# Altium schematic sheet [9]-RELAYS.SchDoc
size A4
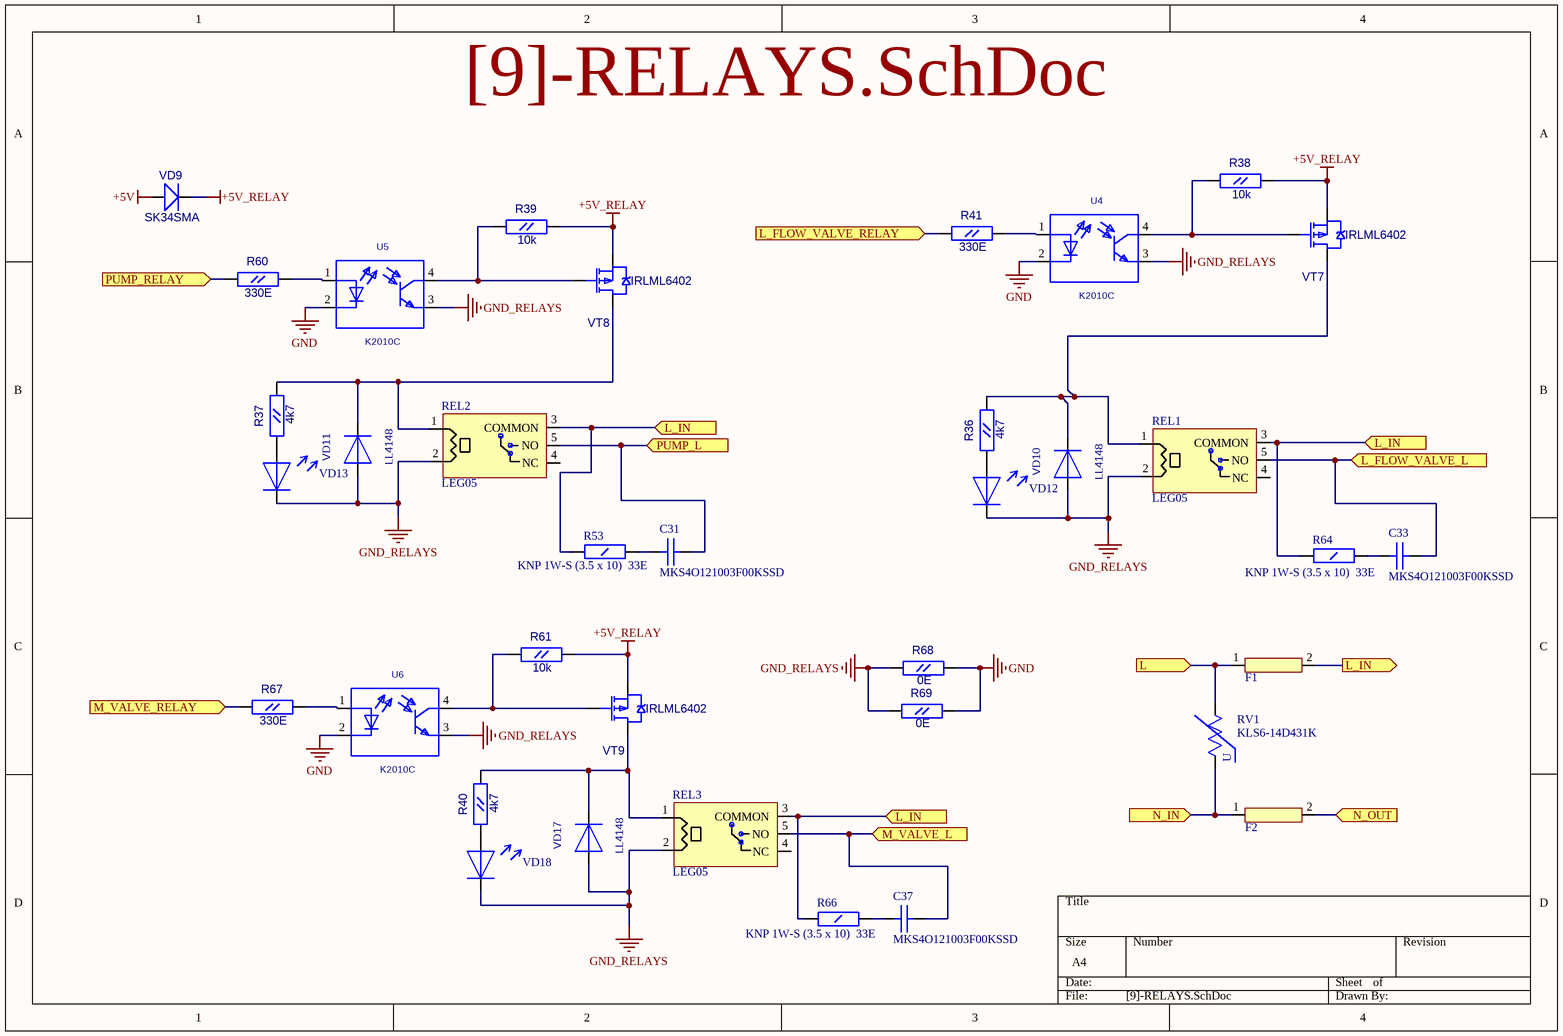
[diagram p0: [9]-RELAYS.SchDoc]

## Parts
C31  MKS4O121003F00KSSD  [CAP_HV_13x5]
C33  MKS4O121003F00KSSD  [CAP_HV_13x5]
C37  MKS4O121003F00KSSD  [CAP_HV_13x5]
F1  KLS5-266(5x20)  [Fuse_5x20]  (value not drawn)
F2  KLS5-266(5x20)  [Fuse_5x20]  (value not drawn)
R36  4k7  [RC0603]
R37  4k7  [RC0603]
R38  10k  [RC0603]
R39  10k  [RC0603]
R40  4k7  [RC0603]
R41  330E  [RC0603]
R53  KNP 1W-S (3.5 x 10)  33E  [RES_10x4_THD]
R60  330E  [RC0603]
R61  10k  [RC0603]
R64  KNP 1W-S (3.5 x 10)  33E  [RES_10x4_THD]
R66  KNP 1W-S (3.5 x 10)  33E  [RES_10x4_THD]
R67  330E  [RC0603]
R68  0E  [RC0805]
R69  0E  [RC0805]
REL1  LEG05  [RELAY_SRD-05]
REL2  LEG05  [RELAY_SRD-05]
REL3  LEG05  [RELAY_SRD-05]
RV1  KLS6-14D431K  [Varistor_14MM]
U4  K2010C  [PC817]
U5  K2010C  [PC817]
U6  K2010C  [PC817]
VD9  SK34SMA  [SMA]
VD10  LL4148  [SOD-80]
VD11  LL4148  [SOD-80]
VD12  LED_0805  [LED0805]  (value not drawn)
VD13  LED_0805  [LED0805]  (value not drawn)
VD17  LL4148  [SOD-80]
VD18  LED_0805  [LED0805]  (value not drawn)
VT7  IRLML6402  [SOT-23(123)]
VT8  IRLML6402  [SOT-23(123)]
VT9  IRLML6402  [SOT-23(123)]

## Ports
L (in), L_FLOW_VALVE_L (in), L_FLOW_VALVE_RELAY (in), L_IN (in), L_IN (out), M_VALVE_L (in), M_VALVE_RELAY (in), N_IN (in), N_OUT (in), PUMP_L (in), PUMP_RELAY (in)

## Nets
+5V: VD9.1(A)
+5V_RELAY: R38.2(B) R39.2(B) R61.2(B) VD9.2(K) VT7.2(S) VT8.2(S) VT9.2(S)
GND: R68.2(B) R69.2(B) U4.2 U5.2 U6.2
GND_RELAYS: R68.1(A) R69.1(A) REL1.2 REL2.2 REL3.2 U4.3 U5.3 U6.3 VD10.1(-) VD11.1(-) VD12.2 VD13.2 VD17.1(-) VD18.2
L: F1.1 RV1.2(B) ; port L
L_FLOW_VALVE_L: C33.2(B) REL1.5(NO) ; port L_FLOW_VALVE_L
L_FLOW_VALVE_RELAY: R41.1(A) ; port L_FLOW_VALVE_RELAY
L_IN: F1.2 R53.2(B) R64.2(B) R66.2(B) REL1.3(COMMON) REL2.3(COMMON) REL3.3(COMMON) ; port L_IN
M_VALVE_L: C37.2(B) REL3.5(NO) ; port M_VALVE_L
M_VALVE_RELAY: R67.1(A) ; port M_VALVE_RELAY
N_IN: F2.1 RV1.1(A) ; port N_IN
N_OUT: F2.2 ; port N_OUT
PUMP_L: C31.2(B) REL2.5(NO) ; port PUMP_L
PUMP_RELAY: R60.1(A) ; port PUMP_RELAY
NetC31_1: C31.1(A) R53.1(A)
NetC33_1: C33.1(A) R64.1(A)
NetC37_1: C37.1(A) R66.1(A)
NetR36_1: R36.1(A) VD12.1
NetR36_2: R36.2(B) REL1.1 VD10.2(+) VT7.3(D)
NetR37_1: R37.1(A) VD13.1
NetR37_2: R37.2(B) REL2.1 VD11.2(+) VT8.3(D)
NetR38_1: R38.1(A) U4.4 VT7.1(G)
NetR39_1: R39.1(A) U5.4 VT8.1(G)
NetR40_1: R40.1(A) VD18.1
NetR40_2: R40.2(B) REL3.1 VD17.2(+) VT9.3(D)
NetR41_2: R41.2(B) U4.1
NetR60_2: R60.2(B) U5.1
NetR61_1: R61.1(A) U6.4 VT9.1(G)
NetR67_2: R67.2(B) U6.1

Not connected (* = marked no-connect by the designer): REL1 4(NC); REL2 4(NC); REL3 4(NC)

## Notes on the sheet
- (in symbol KLS6-14D431K) U

## Library data of the parts
C31 C33 C37 = CAP_HV_13x5: Value: MKS4O121003F00KSSD
F1 F2 = Fuse KLS5-266(5x20): Value: KLS5-266(5x20)
R36-R41 R60 R61 R67 = RC0603
  R36 R37 R40: Value: 4k7
  R38 R39 R61: Value: 10k
  R41 R60 R67: Value: 330E
R53 R64 R66 = RC_1003_THR: THR resisto r10x3mm 0.5W; Value: KNP 1W-S (3.5 x 10)  33E
R68 R69 = RC0805: Value: 0E
REL1-REL3 = SRD-05VDC-SL-C: Relay 5V 70mA Songle; Value: LEG05
RV1 = KLS6-14D431K: Varistor diameter 14mm; Value: KLS6-14D431K
U4-U6 = K10102C: Value: *
VD9 = SK34SMA: Schottky Rectifier; Value: {Value}
VT7-VT9 = IRLML6402: HEXFET Power MOSFET; OriginalName: IRLML5103; ComponentField7: Published 8-Jun-2000; Value: {Value}
VD10 VD11 VD17 = LL4148: Value: *
VD12 VD13 VD18 = LED_0805: Value: LED_0805